# EasyEDA schematic SCH_Ghost_2024-10-19.json
TITLE: Sheet_1; REV: 1.0; Date: 2024-10-11; Sheet: 1/1; Drawn By: taranmittal09; Company: Your Company
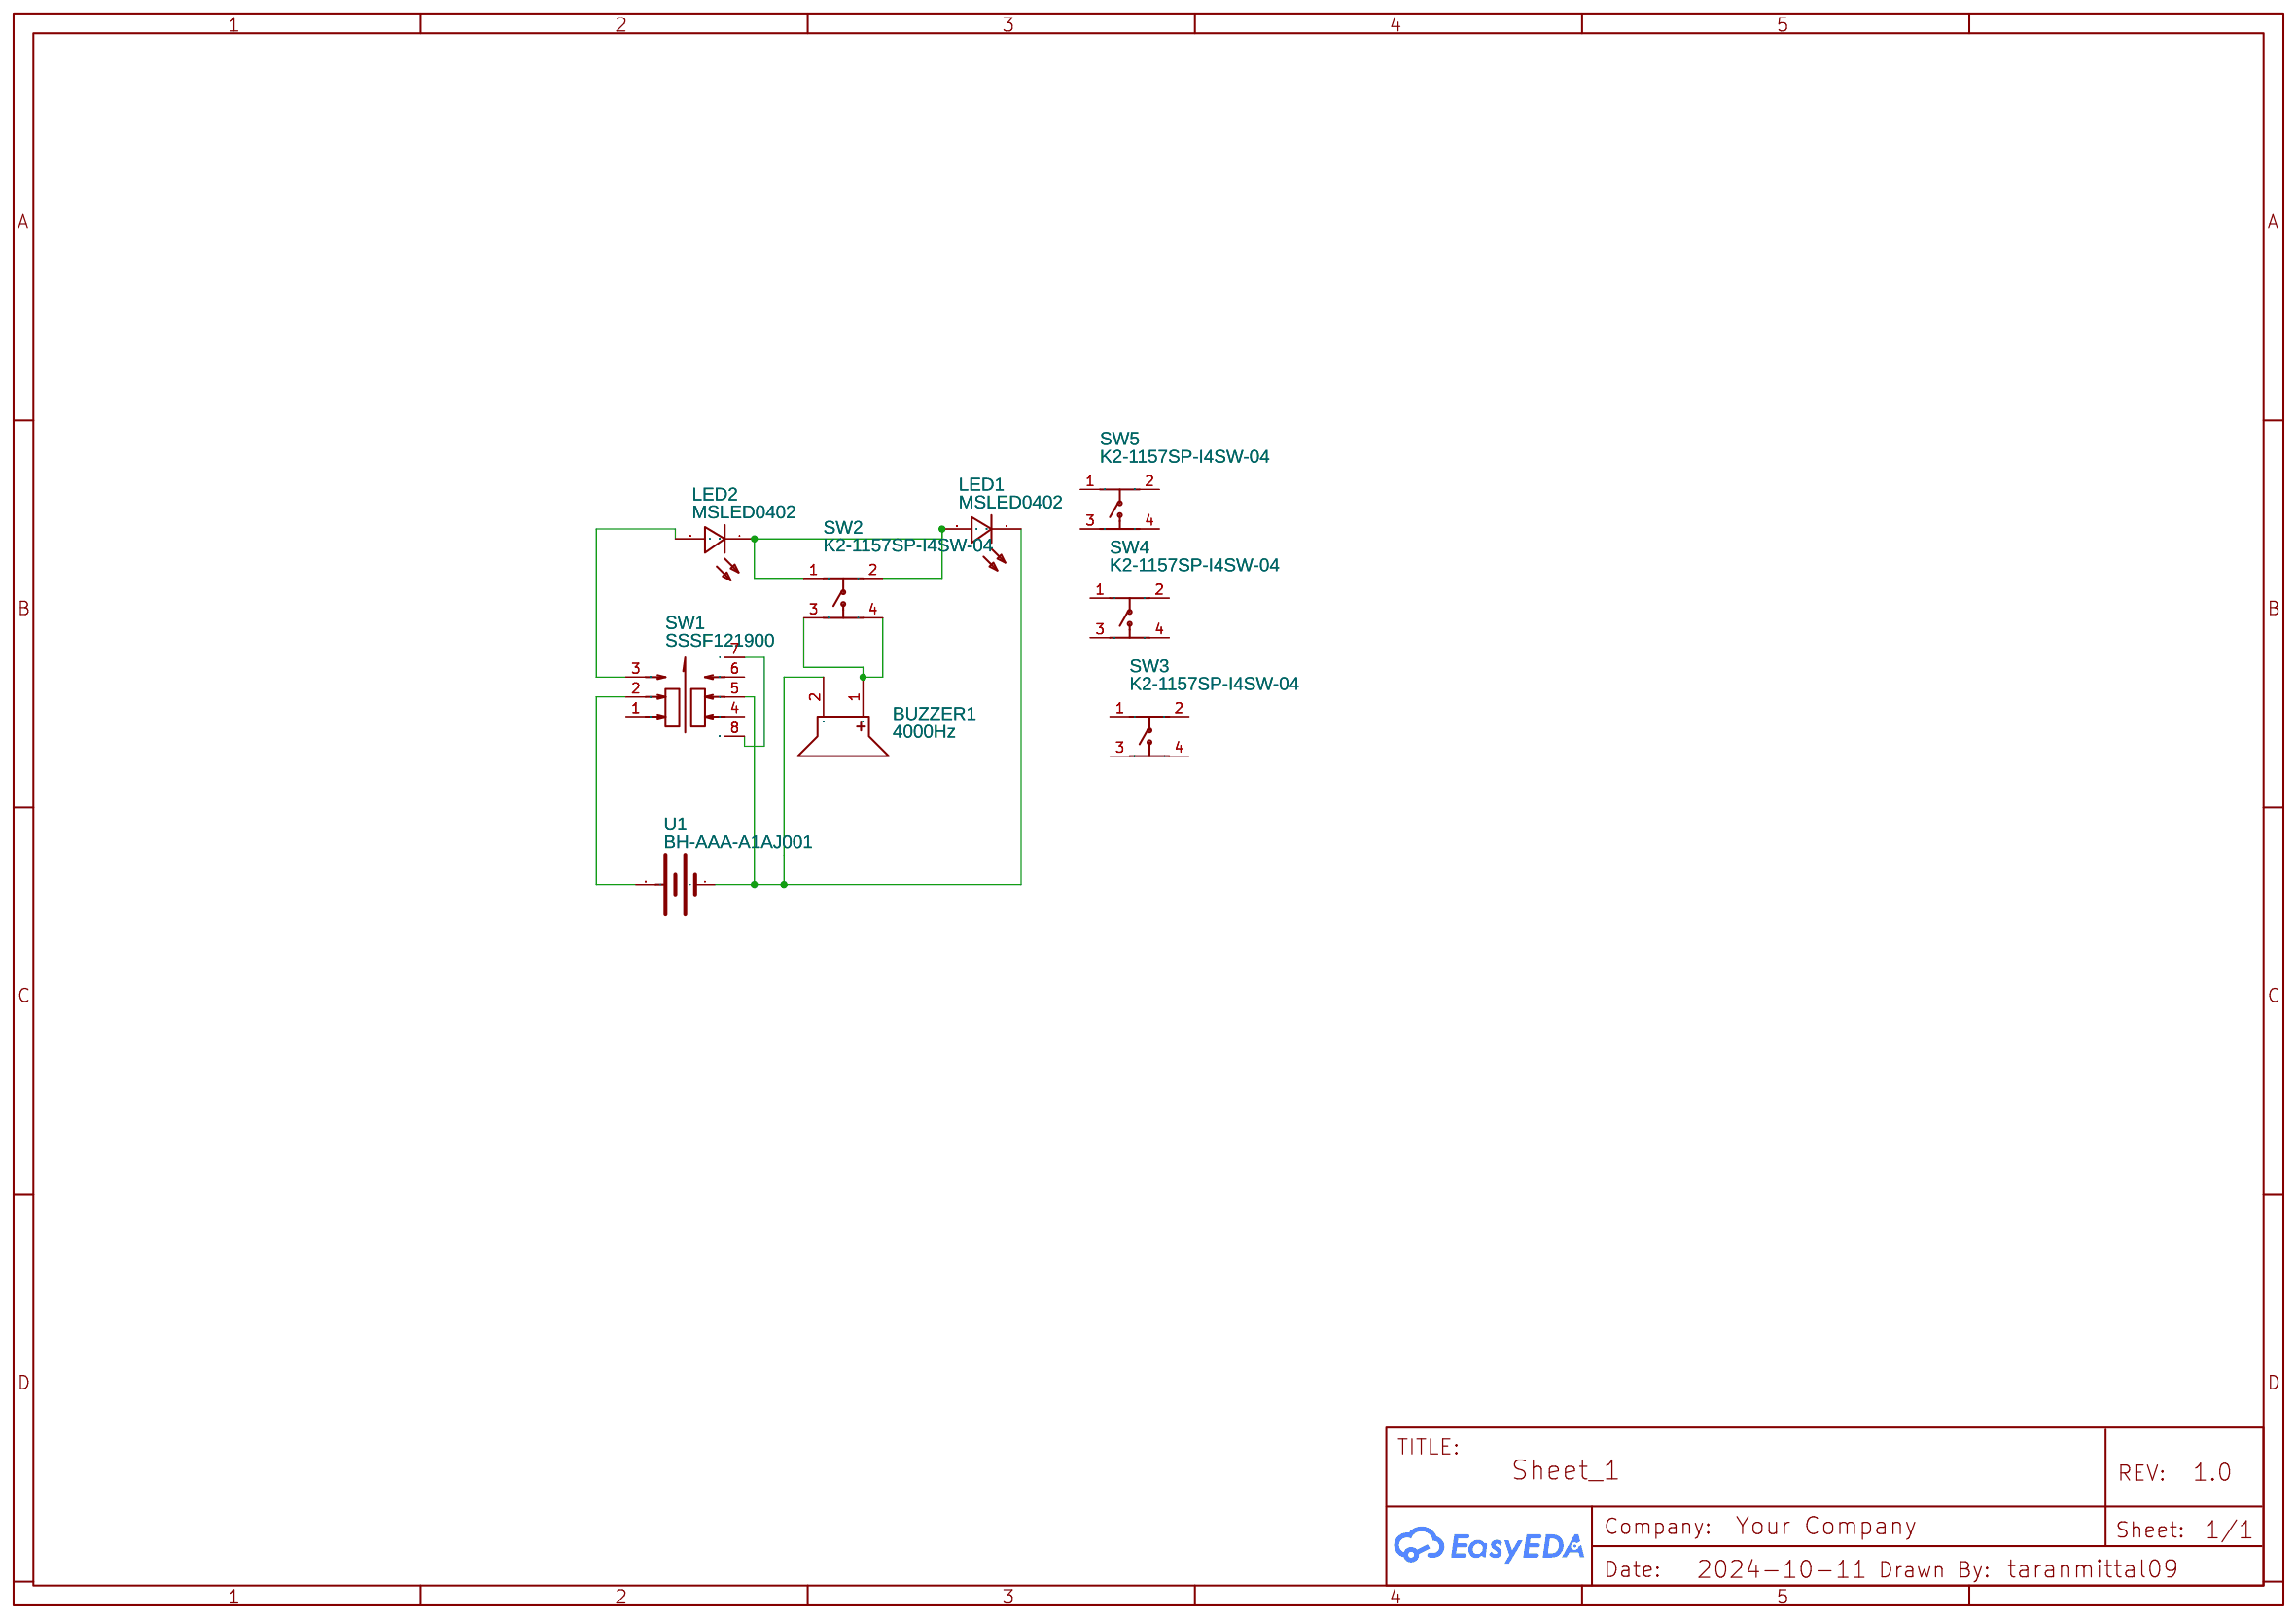
[diagram p0: schematic sheet]

## Parts
BUZZER1  4000Hz  [BUZ-TH_BD14.1-P7.62-D1.0-FD]
LED1  MSLED0402  [LED0402-RD_GREEN]
LED2  MSLED0402  [LED0402-RD_GREEN]
SW1  SSSF121900  [SW-TH_SSSF121900]
SW2  K2-1157SP-I4SW-04  [SW-SMD_4P-L6.2-W6.2-P4.50-LS8.6]
SW3  K2-1157SP-I4SW-04  [SW-SMD_4P-L6.2-W6.2-P4.50-LS8.6]
SW4  K2-1157SP-I4SW-04  [SW-SMD_4P-L6.2-W6.2-P4.50-LS8.6]
SW5  K2-1157SP-I4SW-04  [SW-SMD_4P-L6.2-W6.2-P4.50-LS8.6]
U1  BH-AAA-A1AJ001  [BAT-TH_BH-AAA-A1AJ001]

## Library data of the parts
BUZZER1 = HNR-1407A: Contributor: LCSC; Supplier: LCSC; Manufacturer: 华能; Supplier Part: C128017; JLCPCB Part Class: Extended Part
LED1 LED2 = MSLED0402: Contributor: lcsc; Supplier: LCSC; Supplier Part: C9900013127; Manufacturer: null; JLCPCB Part Class: Extended Part
SW1 = SSSF121900: Contributor: LCSC; Supplier: LCSC; Supplier Part: C97449; Manufacturer: ALPSALPINE(阿尔卑斯阿尔派); JLCPCB Part Class: Extended Part
SW2-SW5 = K2-1157SP-I4SW-04: Contributor: LCSC; Supplier: LCSC; Supplier Part: C2909692; Manufacturer: 韩国韩荣; Manufacturer Part: K2-1157SP-I4SW-01; JLCPCB Part Class: Extended Part
U1 = BH-AAA-A1AJ001: Supplier: LCSC; Supplier Part: C5290189; Manufacturer: MYOUNG(美阳); Contributor: lcsc; JLCPCB Part Class: Extended Part

## Nets
Net-(BUZZER1-1): BUZZER1.1 SW2.3 SW2.4
Net-(BUZZER1-2): BUZZER1.2 LED1.1(C) SW1.5 U1.1(-)
Net-(LED1-2): LED1.2(A) LED2.1(C) SW2.1 SW2.2
Net-(LED2-2): LED2.2(A) SW1.3
Net-(SW1-2): SW1.2 U1.2(+)
Net-(SW1-7): SW1.7 SW1.8

Not connected (* = marked no-connect by the designer): SW1 1 4 6; SW3 1 2 3 4; SW4 1 2 3 4; SW5 1 2 3 4
